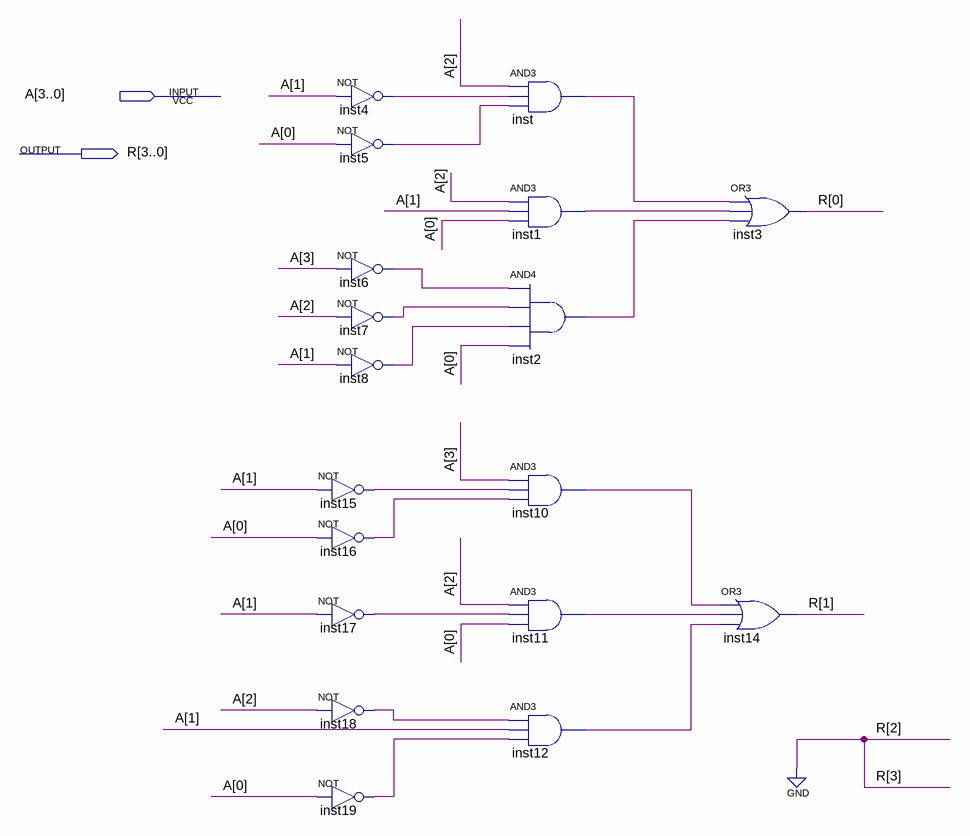
[diagram p0: schematic sheet]
// Quartus schematic RemainderForOneDigit.bdf as structural Verilog: 18 symbols, 2 pins
module RemainderForOneDigit (
  input  [3:0] A,
  output [3:0] R
);

  wire inst1_out, inst2_out, inst4_out, inst5_out, inst6_out, inst7_out, inst8_out, inst10_out, inst11_out,
       inst12_out, inst15_out, inst16_out, inst17_out, inst18_out, inst19_out, inst_out;

  not inst4 (inst4_out, A[1]);
  not inst5 (inst5_out, A[0]);
  not inst6 (inst6_out, A[3]);
  not inst7 (inst7_out, A[2]);
  not inst8 (inst8_out, A[1]);
  not inst15 (inst15_out, A[1]);
  not inst16 (inst16_out, A[0]);
  not inst17 (inst17_out, A[1]);
  not inst18 (inst18_out, A[2]);
  not inst19 (inst19_out, A[0]);
  and inst (inst_out, A[2], inst4_out, inst5_out);
  and inst1 (inst1_out, A[2], A[1], A[0]);
  and inst2 (inst2_out, inst6_out, inst7_out, inst8_out, A[0]);
  and inst10 (inst10_out, A[3], inst15_out, inst16_out);
  and inst11 (inst11_out, A[2], inst17_out, A[0]);
  and inst12 (inst12_out, inst18_out, A[1], inst19_out);
  or inst3 (R[0], inst_out, inst1_out, inst2_out);
  or inst14 (R[1], inst10_out, inst11_out, inst12_out);

  assign R[3:2] = 2'b00;
endmodule
